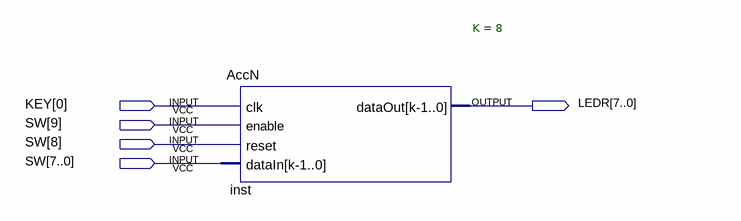
[diagram p0: schematic sheet]
// Quartus schematic AccN_Demo.bdf as structural Verilog: 1 symbols, 5 pins
module AccN_Demo (
  input  [0:0] KEY,
  input  [9:0] SW,
  output [7:0] LEDR
);

  AccN #(.K(8)) inst (.clk(KEY[0]), .enable(SW[9]), .reset(SW[8]), .dataIn(SW[7:0]), .dataOut(LEDR));
endmodule
